# Altium schematic sheet IR_Emitters.SchDoc
size A
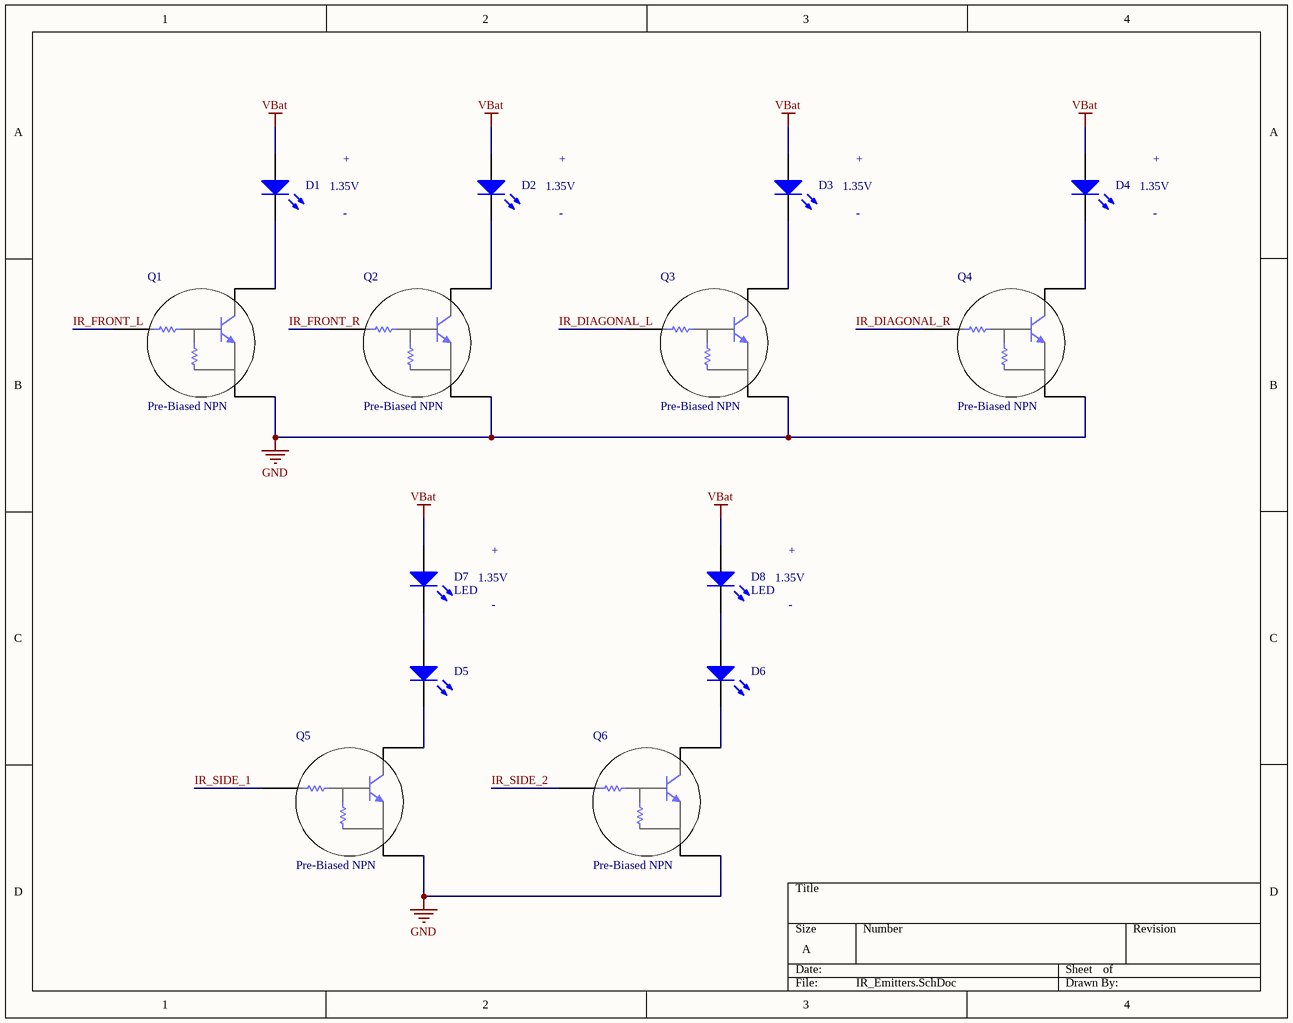
[diagram p0: IR_Emitters.SchDoc]

## Parts
D1  LED  [LED-Bent]  (value not drawn)
D2  LED  [LED-Bent]  (value not drawn)
D3  LED  [LED-Bent]  (value not drawn)
D4  LED  [LED-Bent]  (value not drawn)
D5  LED  [LED-Bent]  (value not drawn)
D6  LED  [LED-Bent]  (value not drawn)
D7  LED  [LED-Bent]
D8  LED  [LED-Bent]
Q1  Pre-Biased NPN  [SOT-416]
Q2  Pre-Biased NPN  [SOT-416]
Q3  Pre-Biased NPN  [SOT-416]
Q4  Pre-Biased NPN  [SOT-416]
Q5  Pre-Biased NPN  [SOT-416]
Q6  Pre-Biased NPN  [SOT-416]

## Nets
GND: Q1.2 Q2.2 Q3.2 Q4.2 Q5.2 Q6.2
VBat: D1.1(A) D2.1(A) D3.1(A) D4.1(A) D7.1(A) D8.1(A)
IR_DIAGONAL_L: Q3.1
IR_DIAGONAL_R: Q4.1
IR_FRONT_L: Q1.1
IR_FRONT_R: Q2.1
IR_SIDE_1: Q5.1
IR_SIDE_2: Q6.1
NetD1_2: D1.2(K) Q1.3
NetD2_2: D2.2(K) Q2.3
NetD3_2: D3.2(K) Q3.3
NetD4_2: D4.2(K) Q4.3
NetD5_1: D5.1(A) D7.2(K)
NetD5_2: D5.2(K) Q5.3
NetD6_1: D6.1(A) D8.2(K)
NetD6_2: D6.2(K) Q6.3

## Notes on the sheet
- +
- 1.35V
- -

## Library data of the parts
D1-D8 = LED: Vendor Part Number: 751-1203-ND; Manufacturer: Vishay; Manufacturer Part Number: TSAL6100; Vendor: Digikey; Published: 16-Mar-2013; LatestRevisionDate: 16-Mar-2013; LatestRevisionNote: Created; PackageReference: LED; Publisher: Anthony Merlino; PackageDescription: 5mm LED; 2 Leads
Q1-Q6 = Pre-Biased NPN: Manufacturer Part No: DTD743EETL; Vendor Part No: DTD743EETLTR-ND; Vendor: Digikey